# EAGLE schematic Order339499-SandyNoble-Polarshield v1.4a (EAGLE 6.4)
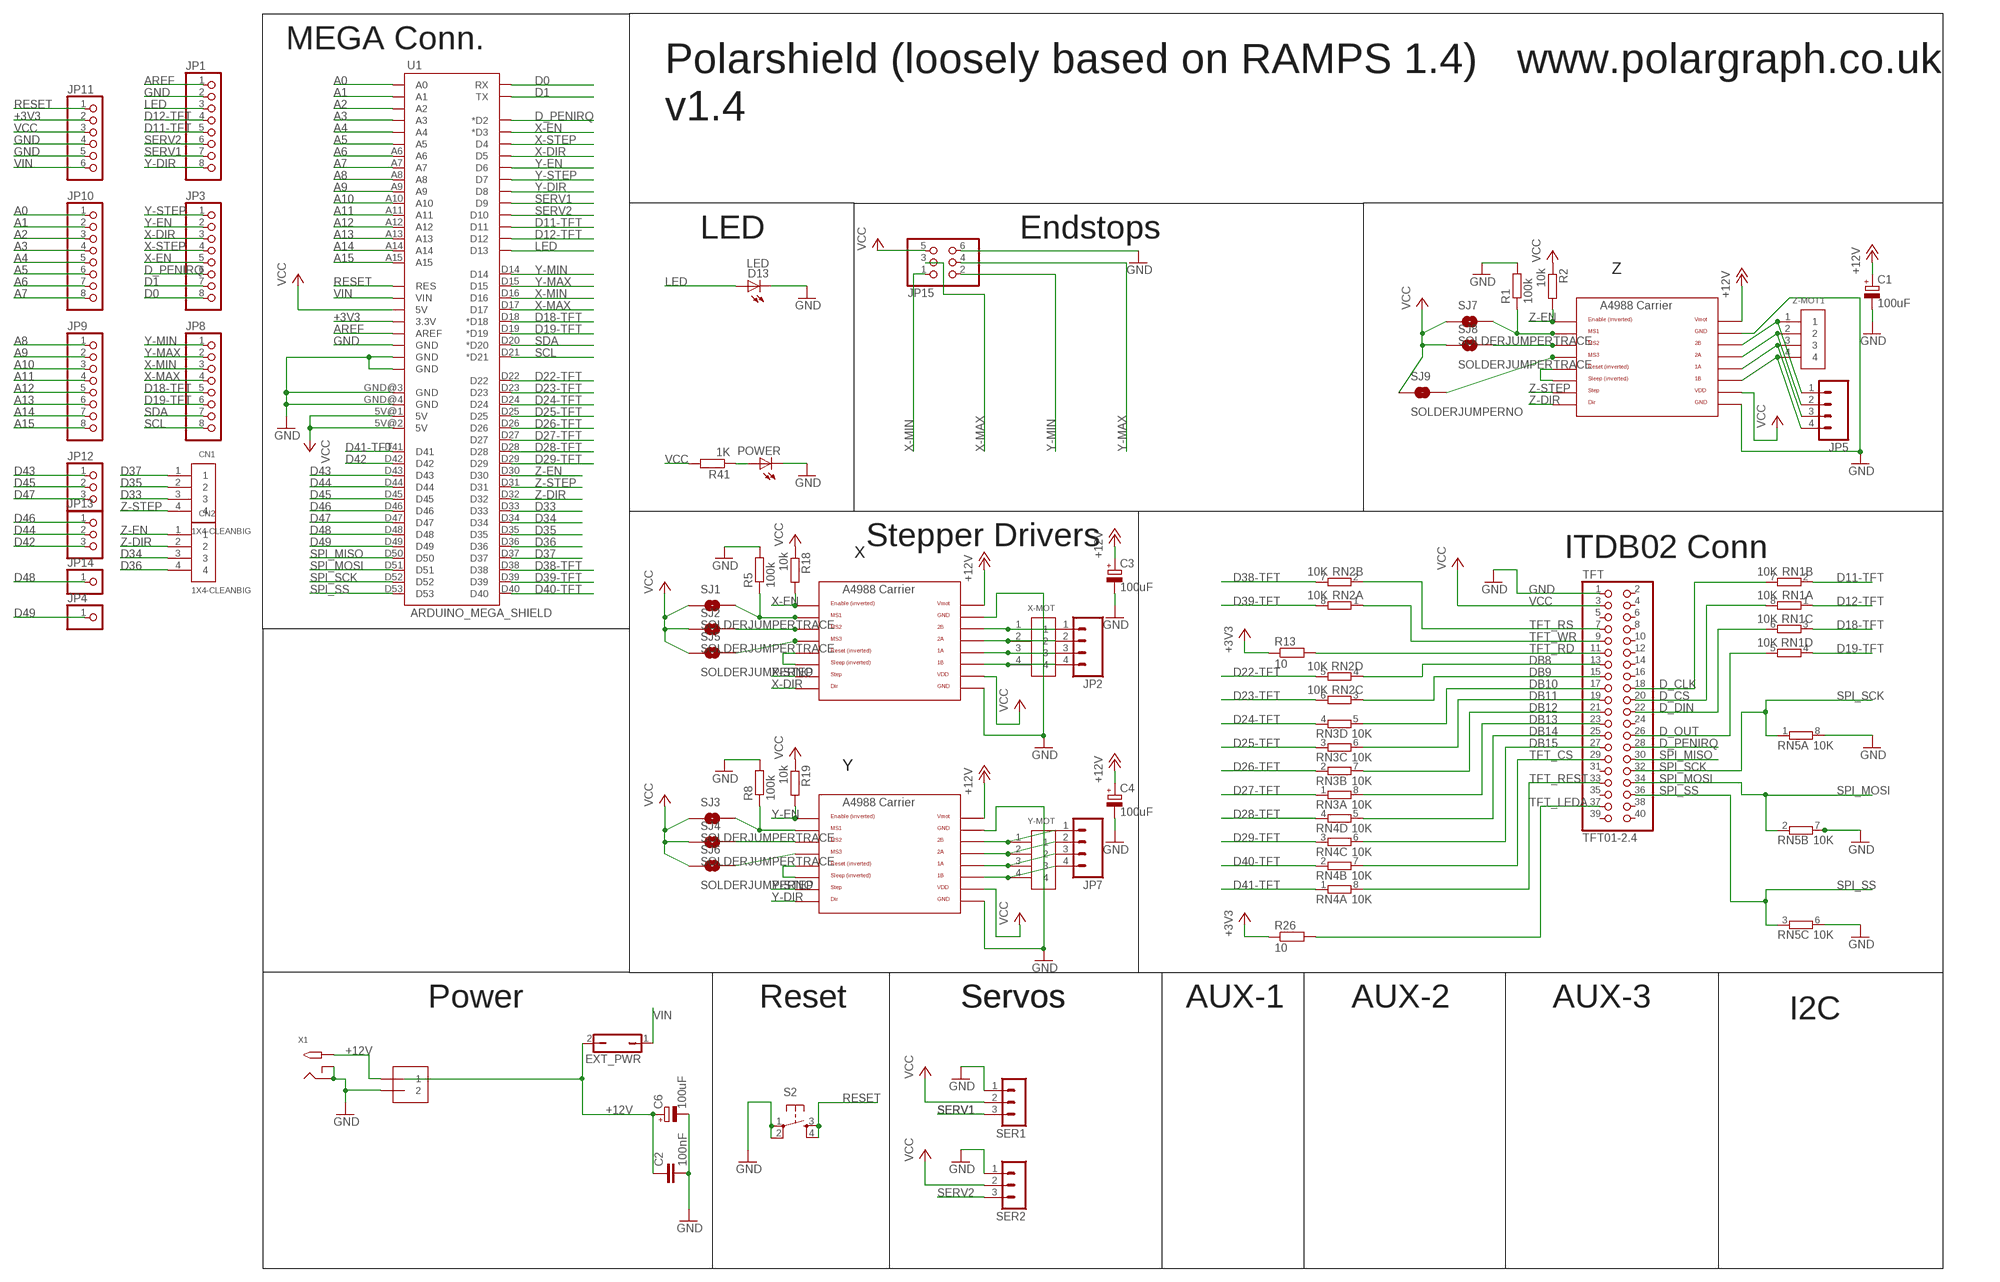
[diagram p0: schematic, sheet 1]

## Parts
C1  100uF  CPOL-EU153CLV-0605  [153CLV-0605]
C2  100nF  C-EUC0805  [C0805]
C3  100uF  CPOL-EU153CLV-0605  [153CLV-0605]
C4  100uF  CPOL-EU153CLV-0605  [153CLV-0605]
C6  100uF  CPOL-EU153CLV-0605  [153CLV-0605]
CN1  1X4-CLEANBIG  [1X04-CLEANBIG]
CN2  1X4-CLEANBIG  [1X04-CLEANBIG]
D13  LED  LEDCHIP-LED0805  [CHIP-LED0805]
EXT_PWR  JP1Q  [JP1]
J1  1X2-3.5MM  [1X2-3.5MM]
JP1  PINHD-1X8CLEANBIG  [1X08-CLEANBIG]
JP2  M04SCREW  [SCREWTERMINAL-3.5MM-4]
JP3  PINHD-1X8CLEANBIG  [1X08-CLEANBIG]
JP4  PINHD-1X1CB  [1X01-CLEANBIG]
JP5  M04SCREW  [SCREWTERMINAL-3.5MM-4]
JP7  M04SCREW  [SCREWTERMINAL-3.5MM-4]
JP8  PINHD-1X8CLEANBIG  [1X08-CLEANBIG]
JP9  PINHD-1X8CLEANBIG  [1X08-CLEANBIG]
JP10  PINHD-1X8CLEANBIG  [1X08-CLEANBIG]
JP11  PINHD-1X6CB  [1X06-CLEANBIG]
JP12  PINHD-1X3CB  [1X03-CLEANBIG]
JP13  PINHD-1X3CB  [1X03-CLEANBIG]
JP14  PINHD-1X1CB  [1X01-CLEANBIG]
JP15  PINHD-2X3  [2X03]
POWER  LEDCHIP-LED0805  [CHIP-LED0805]
R1  100k  R-EU_R0805  [R0805]
R2  10k  R-EU_R0805  [R0805]
R5  100k  R-EU_R0805  [R0805]
R8  100k  R-EU_R0805  [R0805]
R13  10  R-EU_R0805  [R0805]
R18  10k  R-EU_R0805  [R0805]
R19  10k  R-EU_R0805  [R0805]
R26  10  R-EU_R0805  [R0805]
R41  1K  R-EU_R0805  [R0805]
RN1  10K  4R-NEXBS8V  [EXBS8V]
RN2  10K  4R-NEXBS8V  [EXBS8V]
RN3  10K  4R-NEXBS8V  [EXBS8V]
RN4  10K  4R-NEXBS8V  [EXBS8V]
RN5  10K  4R-NEXBS8V  [EXBS8V]
S2  TAC_SWITCHPTH  [TACTILE-PTH]
SER1  3PIN-HEADER  [3PIN-HEADER]
SER2  3PIN-HEADER  [3PIN-HEADER]
SJ1  SOLDERJUMPERTRACE  [SJ_2S-TRACE]
SJ2  SOLDERJUMPERTRACE  [SJ_2S-TRACE]
SJ3  SOLDERJUMPERTRACE  [SJ_2S-TRACE]
SJ4  SOLDERJUMPERTRACE  [SJ_2S-TRACE]
SJ5  SOLDERJUMPERNO  [SJ_2S-NO]
SJ6  SOLDERJUMPERNO  [SJ_2S-NO]
SJ7  SOLDERJUMPERTRACE  [SJ_2S-TRACE]
SJ8  SOLDERJUMPERTRACE  [SJ_2S-TRACE]
SJ9  SOLDERJUMPERNO  [SJ_2S-NO]
TFT  TFT01-2.4  [TFT01-2.4]
U1  ARDUINO_MEGA_SHIELD  [ARDUINO_MEGA_SHIELD]
U$1  A4988BREAKOUT  [A4988BREAKOUT]
U$6  A4988BREAKOUT  [A4988BREAKOUT]
U$7  A4988BREAKOUT  [A4988BREAKOUT]
X1  2.1MMJACKTHM  [PJ-102A]
X-MOT  1X4-BIG  [1X04-BIG]
Y-MOT  1X4-BIG  [1X04-BIG]
Z-MOT1  1X4-BIG  [1X04-BIG]

## Nets
+3V3: JP11.2 R13.1 R26.1 U1.3.3V
+12V [vcc]: C1.+ C2.1 C3.+ C4.+ C6.+ EXT_PWR.2 J1.1 U$1.VMOT U$6.VMOT U$7.VMOT X1.TIP
A0: JP10.1 U1.A0
A1: JP10.2 U1.A1
A2: JP10.3 U1.A2
A3: JP10.4 U1.A3
A4: JP10.5 U1.A4
A5: JP10.6 U1.A5
A6: JP10.7 U1.A6
A7: JP10.8 U1.A7
A8: JP9.1 U1.A8
A9: JP9.2 U1.A9
A10: JP9.3 U1.A10
A11: JP9.4 U1.A11
A12: JP9.5 U1.A12
A13: JP9.6 U1.A13
A14: JP9.7 U1.A14
A15: JP9.8 U1.A15
AREF: JP1.1 U1.AREF
D0: JP3.8 U1.RX
D1: JP3.7 U1.TX
D11-TFT: JP1.5 RN1.2 U1.D11
D12-TFT: JP1.4 RN1.1 U1.D12
D18-TFT: JP8.5 RN1.3 U1.D18(*D18)
D19-TFT [signal]: JP8.6 RN1.4 U1.D19(*D19)
D22-TFT: RN2.5 U1.D22
D23-TFT: RN2.6 U1.D23
D24-TFT: RN3.4 U1.D24
D25-TFT: RN3.3 U1.D25
D26-TFT: RN3.2 U1.D26
D27-TFT: RN3.1 U1.D27
D28-TFT: RN4.4 U1.D28
D29-TFT: RN4.3 U1.D29
D33: CN1.3 U1.D33
D34: CN2.3 U1.D34
D35: CN1.2 U1.D35
D36: CN2.4 U1.D36
D37: CN1.1 U1.D37
D38-TFT: RN2.7 U1.D38
D39-TFT: RN2.8 U1.D39
D40-TFT: RN4.2 U1.D40
D41-TFT: RN4.1 U1.D41
D42: JP13.3 U1.D42
D43: JP12.1 U1.D43
D44: JP13.2 U1.D44
D45: JP12.2 U1.D45
D46: JP13.1 U1.D46
D47: JP12.3 U1.D47
D48: JP14.1 U1.D48
D49: JP4.1 U1.D49
D_CLK: RN1.7 TFT.18
D_CS: RN1.8 TFT.20
D_DIN: RN1.6 TFT.22
D_OUT: RN1.5 TFT.26
D_PENIRQ: JP3.6 TFT.28 U1.D2(*D2)
DB8: RN2.4 TFT.13
DB9: RN2.3 TFT.15
DB10: RN3.5 TFT.17
DB11: RN3.6 TFT.19
DB12: RN3.7 TFT.21
DB13: RN3.8 TFT.23
DB14: RN4.5 TFT.25
DB15: RN4.6 TFT.27
GND: C1.- C2.2 C3.- C4.- C6.- D13.C J1.2 JP1.2 JP11.4 JP11.5 JP15.6 POWER.C R1.2 R5.2 R8.2 RN5.6 RN5.7 RN5.8 S2.1 S2.2 SER1.1 SER2.1 TFT.1 U1.GND@0(GND) U1.GND@1(GND) U1.GND@2(GND) U1.GND@3(GND) U1.GND@4(GND) U$1.GND U$1.GND@0(GND) U$6.GND U$6.GND@0(GND) U$7.GND U$7.GND@0(GND) X1.RING X1.RING_SW
LED: D13.A JP1.3 U1.D13
N$1: U$6.RST U$6.SLP(SLEEP)
N$2: POWER.A R41.1
N$3: R5.1 SJ1.2 U$6.MS1
N$4: JP5.1 U$1.2B Z-MOT1.1
N$5: JP5.2 U$1.2A Z-MOT1.2
N$6: JP5.3 U$1.1A Z-MOT1.3
N$7: JP5.4 U$1.1B Z-MOT1.4
N$8: U$1.RST U$1.SLP(SLEEP)
N$9: R1.1 SJ7.2 U$1.MS1
N$10: SJ2.2 U$6.MS2
N$11: SJ8.2 U$1.MS2
N$12: SJ5.2 U$6.MS3
N$13: U$7.RST U$7.SLP(SLEEP)
N$14: SJ9.2 U$1.MS3
N$17: SJ4.2 U$7.MS2
N$21: JP2.1 U$6.2B X-MOT.1
N$22: JP2.2 U$6.2A X-MOT.2
N$26: JP2.3 U$6.1A X-MOT.3
N$27: JP2.4 U$6.1B X-MOT.4
N$28: JP7.1 U$7.2B Y-MOT.1
N$29: JP7.2 U$7.2A Y-MOT.2
N$30: JP7.3 U$7.1A Y-MOT.3
N$31: SJ6.2 U$7.MS3
N$33: R8.1 SJ3.2 U$7.MS1
N$36: JP7.4 U$7.1B Y-MOT.4
RESET: JP11.1 S2.3 S2.4 U1.RES
SCL: JP8.8 U1.D21(*D21)
SDA: JP8.7 U1.D20(*D20)
SERV1: JP1.7 SER1.3 U1.D9
SERV2: JP1.6 SER2.3 U1.D10
SPI_MISO: TFT.30 U1.D50
SPI_MOSI: RN5.2 TFT.34 U1.D51
SPI_SCK: RN5.1 TFT.32 U1.D52
SPI_SS: RN5.3 TFT.36 U1.D53
TFT_CS: RN4.7 TFT.29
TFT_LEDA: R26.2 TFT.37
TFT_RD: R13.2 TFT.11
TFT_REST: RN4.8 TFT.33
TFT_RS: RN2.2 TFT.7
TFT_WR: RN2.1 TFT.9
VCC: JP11.3 JP15.5 R2.1 R18.1 R19.1 R41.2 SER1.2 SER2.2 SJ1.1 SJ2.1 SJ3.1 SJ4.1 SJ5.1 SJ6.1 SJ7.1 SJ8.1 SJ9.1 TFT.3 U1.5V@0(5V) U1.5V@1(5V) U1.5V@2(5V) U$1.VDD U$6.VDD U$7.VDD
VIN [vcc]: EXT_PWR.1 JP11.6 U1.VIN
X-DIR: JP3.3 U1.D5 U$6.DIR
X-EN: JP3.5 R18.2 U1.D3(*D3) U$6.EN
X-MAX: JP8.4 JP15.3 U1.D17
X-MIN: JP8.3 JP15.1 U1.D16
X-STEP: JP3.4 U1.D4 U$6.STEP
Y-DIR: JP1.8 U1.D8 U$7.DIR
Y-EN: JP3.2 R19.2 U1.D6 U$7.EN
Y-MAX: JP8.2 JP15.4 U1.D15
Y-MIN: JP8.1 JP15.2 U1.D14
Y-STEP: JP3.1 U1.D7 U$7.STEP
Z-DIR: CN2.2 U1.D32 U$1.DIR
Z-EN: CN2.1 R2.2 U1.D30 U$1.EN
Z-STEP: CN1.4 U1.D31 U$1.STEP
Unconnected: RN5.4 RN5.5 TFT.2 TFT.4 TFT.5 TFT.6 TFT.8 TFT.10 TFT.12 TFT.14 TFT.16 TFT.24 TFT.31 TFT.35 TFT.38 TFT.39 TFT.40

## Notes on the sheet
- MEGA Conn.
- Polarshield (loosely based on RAMPS 1.4) | www.polargraph.co.uk
- v1.4
- LED | Endstops
- Z
- Stepper Drivers
- X | ITDB02 Conn
- Y
- Power | Reset | Servos | Servos | AUX-1 | AUX-2 | AUX-3
- I2C

## Library data of the parts
C1 C3 C4 C6 = rcl:CPOL-EU: POLARIZED CAPACITOR, European symbol
C2 = resistor:C-EU: CAPACITOR, European symbol
CN1 CN2 X-MOT Y-MOT Z-MOT1 = adafruit:1X4: 4-pin connector
D13 POWER = led:LED: LED OSRAM: - CHIPLED LG R971, LG N971, LY N971, LG Q971, LY Q971, LO R971, LY R971 LH N974, LH R974 LS Q976, LO Q976, LY Q976 LO Q996 - Hyper CHIPLED LW Q18S LB Q993, LB Q99A, LB R99A - SideLED LS A670, LO A670, LY A670, LG A670, LP A670 LB A673, LV A673, LT A673, LW A673 LH A674 LY A675 LS A676, LA A676, LO A676, LY A676, LW A676 LS A679, LY A679, LG A679 - Hyper Micro SIDELED® LS Y876, LA Y876, LO Y876, LY Y876 LT Y87S - SmartLED LW L88C, LW L88S LB L89C, LB L89S, LG L890 LS L89K, LO L89K, LY L89K LS L896, LA L896, LO L896, LY L896 - TOPLED LS T670, LO T670, LY T670, LG T670, LP T670 LSG T670, LSP T670, LSY T670, LOP T670, LYG T670 LG T671, LOG T671, LSG T671 LB T673, LV T673, LT T673, LW T673 LH T674 LS T676, LA T676, LO T676, LY T676, LB T676, LH T676, LSB T676, LW T676 LB T67C, LV T67C, LT T67C, LS T67K, LO T67K, LY T67K, LW E67C LS E67B, LA E67B, LO E67B, LY E67B, LB E67C, LV E67C, LT E67C LW T67C LS T679, LY T679, LG T679 LS T770, LO T770, LY T770, LG T770, LP T770 LB T773, LV T773, LT T773, LW T773 LH T774 LS E675, LA E675, LY E675, LS T675 LS T776, LA T776, LO T776, LY T776, LB T776 LHGB T686 LT T68C, LB T68C - Hyper Mini TOPLED® LB M676 - Mini TOPLED Santana® LG M470 LS M47K, LO M47K, LY M47K Source: http://www.osram.convergy.de LUXEON: - LUMILED® LXK2-PW12-R00, LXK2-PW12-S00, LXK2-PW14-U00, LXK2-PW14-V00 LXK2-PM12-R00, LXK2-PM12-S00, LXK2-PM14-U00 LXK2-PE12-Q00, LXK2-PE12-R00, LXK2-PE12-S00, LXK2-PE14-T00, LXK2-PE14-U00 LXK2-PB12-K00, LXK2-PB12-L00, LXK2-PB12-M00, LXK2-PB14-N00, LXK2-PB14-P00, LXK2-PB14-Q00 LXK2-PR12-L00, LXK2-PR12-M00, LXK2-PR14-Q00, LXK2-PR14-R00 LXK2-PD12-Q00, LXK2-PD12-R00, LXK2-PD12-S00 LXK2-PH12-R00, LXK2-PH12-S00 LXK2-PL12-P00, LXK2-PL12-Q00, LXK2-PL12-R00 Source: www.luxeon.com KINGBRIGHT: KA-3528ASYC Source: www.kingbright.com
EXT_PWR = jumper:JP1Q: JUMPER
J1 = adafruit:1X2: 3.5mm Terminal block http://www.ladyada.net/library/pcb/eaglelibrary.html
JP1 JP3 JP8-JP10 = adafruit:PINHD-1X8: PIN HEADER
JP2 JP5 JP7 = SparkFun:M04: Header 4 Standard 4-pin 0.1" header. Use with straight break away headers (SKU : PRT-00116), right angle break away headers (PRT-00553), swiss pins (PRT-00743), machine pins (PRT-00117), and female headers (PRT-00115). Molex polarized connector foot print use with SKU : PRT-08231 with associated crimp pins and housings. 1MM SMD Version SKU: PRT-10208
JP4 JP14 = adafruit:PINHD-1X1: Pin header 1x1 for 0.1" spacing With round pins
JP11 = adafruit:PINHD-1X6: PIN HEADER
JP12 JP13 = adafruit:PINHD-1X3: PIN HEADER
JP15 = pinhead:PINHD-2X3: PIN HEADER
R1 R2 R5 R8 R18 R19 R41 = rcl:R-EU_: RESISTOR, European symbol
R13 R26 = resistor:R-EU_: RESISTOR, European symbol
RN1-RN5 = resistor-dil:4R-N: Array Chip Resistor Source: RS Component / Phycomp; OC_FARNELL: unknown; OC_NEWARK: unknown
S2 = SparkFun:TAC_SWITCH: Momentary Switch Button commonly used for reset or general input. Spark Fun Electronics SKU : COM-00097
SER1 SER2 = ultimachine:3PIN-HEADER: PIN HEADER
SJ1-SJ9 = SparkFun:SOLDERJUMPER: Solder Jumper Standard SMD solder jumper. Used to automate production. Two varients : Normally Open and Normally Closed are the same, but have different paste layers. NC will have a large amount of paste and should jumper during reflow.
TFT = sandy:TFT01-2.4
U1 = RepRapjr:ARDUINO_MEGA_SHIELD
U$1 U$6 U$7 = RepRapjr:A4988BREAKOUT
X1 = adafruit:2.1MMJACK: 2.1mm x 5.5mm THM DC jack with internal switch. Digikey part #PJ-102A, 4UCON part #05537 2.1mm x 5.5mm SMT DC jack with internal switch. Digikey part #PJ-002A-SMT, 4UCON part #03267 By microbuilder.eu & adafruit.com

## Net classes
1 gnd12: width 2.54 mm
2 gnd5: width 2.54 mm
3 vmot: width 2.54 mm
4 vcc: width 0.406 mm
5 signal: width 0.406 mm